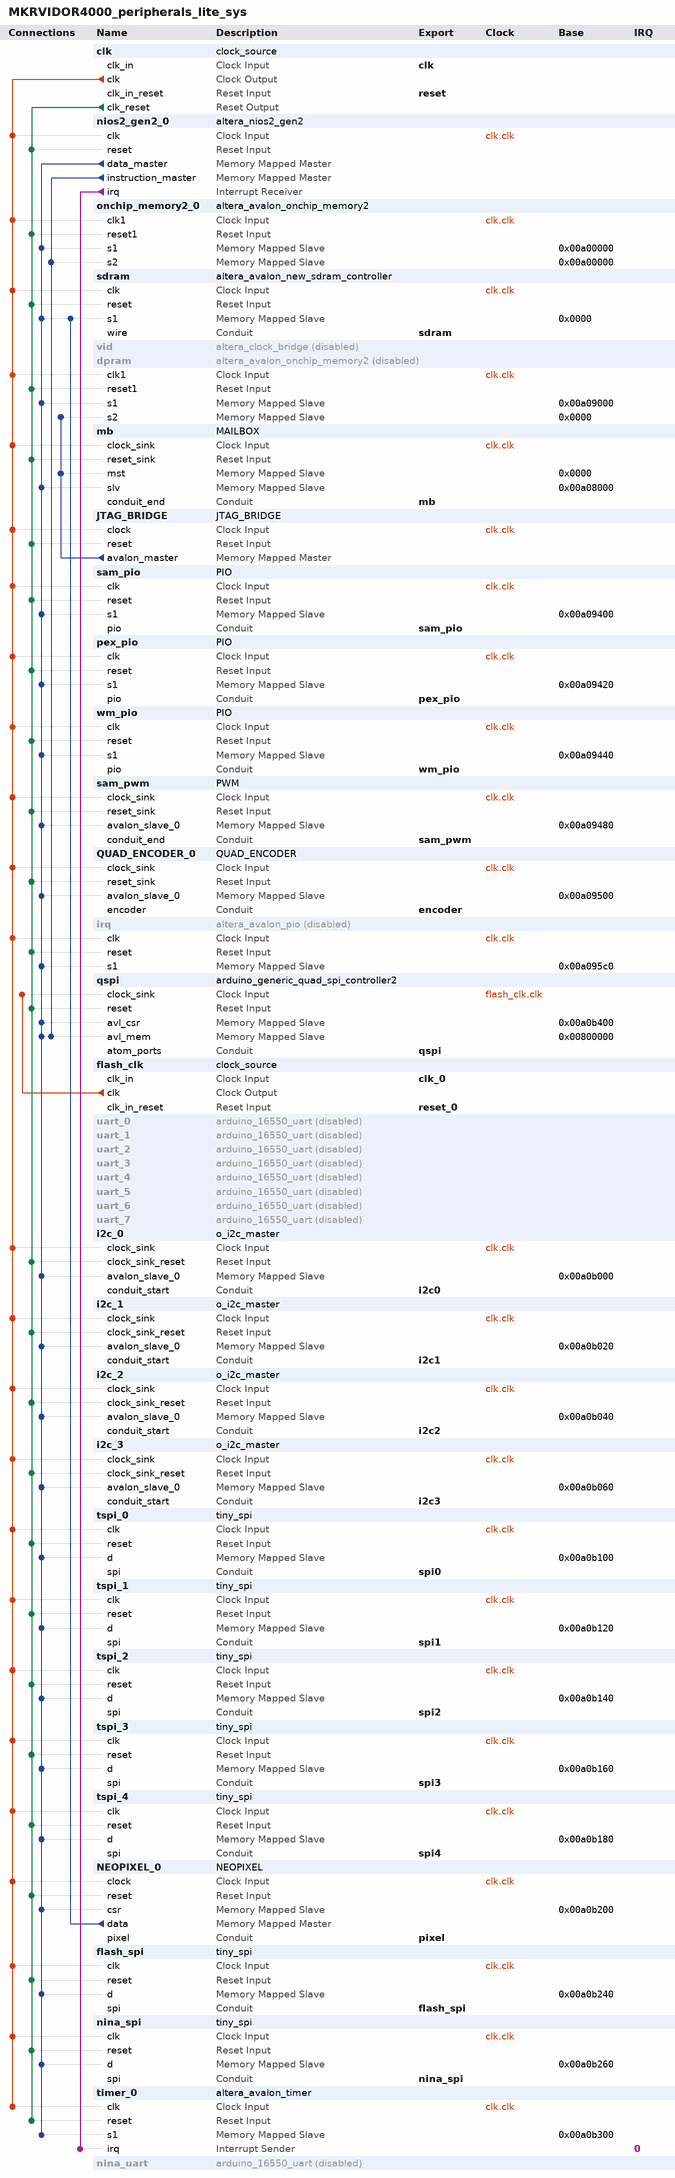
[diagram p0: system contents]
# Platform Designer (Qsys) system MKRVIDOR4000_peripherals_lite_sys, Cyclone 10 LP 10CL016YU256C8G
# Parameters at their usual value, and those the tool derives, are not listed.
package require -exact qsys 18.1
create_system MKRVIDOR4000_peripherals_lite_sys
set_project_property DEVICE_FAMILY {Cyclone 10 LP}
set_project_property DEVICE 10CL016YU256C8G

add_instance clk clock_source 18.1
set_instance_parameter_value clk clockFrequency 100000000

add_instance nios2_gen2_0 altera_nios2_gen2 18.1
set_instance_parameter_value nios2_gen2_0 dcache_size 0
set_instance_parameter_value nios2_gen2_0 debug_enabled false
set_instance_parameter_value nios2_gen2_0 debug_hwbreakpoint 4
set_instance_parameter_value nios2_gen2_0 exceptionSlave onchip_memory2_0.s2
set_instance_parameter_value nios2_gen2_0 icache_size 0
set_instance_parameter_value nios2_gen2_0 impl Tiny
set_instance_parameter_value nios2_gen2_0 resetSlave onchip_memory2_0.s2
set_instance_parameter_value nios2_gen2_0 setting_interruptControllerType External
set_instance_parameter_value nios2_gen2_0 setting_shadowRegisterSets 1

add_instance onchip_memory2_0 altera_avalon_onchip_memory2 18.1
set_instance_parameter_value onchip_memory2_0 dataWidth 32
set_instance_parameter_value onchip_memory2_0 dualPort true
set_instance_parameter_value onchip_memory2_0 initMemContent true
set_instance_parameter_value onchip_memory2_0 initializationFileName onchip_mem.hex
set_instance_parameter_value onchip_memory2_0 memorySize 32768
set_instance_parameter_value onchip_memory2_0 singleClockOperation true

add_instance sdram altera_avalon_new_sdram_controller 18.1
set_instance_parameter_value sdram TAC 5.4
set_instance_parameter_value sdram TRCD 20.0
set_instance_parameter_value sdram TRP 20.0
set_instance_parameter_value sdram casLatency 2
set_instance_parameter_value sdram columnWidth 8
set_instance_parameter_value sdram dataWidth 16
set_instance_parameter_value sdram generateSimulationModel false
set_instance_parameter_value sdram model single_Micron_MT48LC4M32B2_7_chip
set_instance_parameter_value sdram numberOfBanks 4
set_instance_parameter_value sdram numberOfChipSelects 1
set_instance_parameter_value sdram powerUpDelay 200.0
set_instance_parameter_value sdram refreshPeriod 31.25
set_instance_parameter_value sdram rowWidth 12

add_instance vid altera_clock_bridge 18.1
set_instance_property vid ENABLED false
set_instance_parameter_value vid DERIVED_CLOCK_RATE 0
set_instance_parameter_value vid EXPLICIT_CLOCK_RATE 0

add_instance dpram altera_avalon_onchip_memory2 18.1
set_instance_property dpram ENABLED false
set_instance_parameter_value dpram dataWidth 32
set_instance_parameter_value dpram dualPort true
set_instance_parameter_value dpram initMemContent true
set_instance_parameter_value dpram initializationFileName onchip_mem.hex
set_instance_parameter_value dpram memorySize 1024
set_instance_parameter_value dpram singleClockOperation true

add_instance mb MAILBOX 1.0
set_instance_parameter_value mb pDPRAM_BITS 9
set_instance_parameter_value mb pFIFO_BITS 4

add_instance JTAG_BRIDGE JTAG_BRIDGE 1.0

add_instance sam_pio PIO 1.0
set_instance_parameter_value sam_pio pBITS 32
set_instance_parameter_value sam_pio pMUX_BITS 2

add_instance pex_pio PIO 1.0
set_instance_parameter_value pex_pio pBITS 32
set_instance_parameter_value pex_pio pMUX_BITS 2

add_instance wm_pio PIO 1.0
set_instance_parameter_value wm_pio pBITS 32
set_instance_parameter_value wm_pio pMUX_BITS 2

add_instance sam_pwm PWM 1.0
set_instance_parameter_value sam_pwm pCHANNELS 23
set_instance_parameter_value sam_pwm pMATCH_BITS 16
set_instance_parameter_value sam_pwm pPRESCALER_BITS 32

add_instance QUAD_ENCODER_0 QUAD_ENCODER 1.0
set_instance_parameter_value QUAD_ENCODER_0 pENCODERS 11
set_instance_parameter_value QUAD_ENCODER_0 pENCODER_PRECISION 16

add_instance irq altera_avalon_pio 18.1
set_instance_property irq ENABLED false
set_instance_parameter_value irq captureEdge true
set_instance_parameter_value irq direction InOut
set_instance_parameter_value irq generateIRQ true
set_instance_parameter_value irq irqType EDGE
set_instance_parameter_value irq width 2

add_instance qspi arduino_generic_quad_spi_controller2 18.1
set_instance_parameter_value qspi ATOM UNIDIRECTIONAL
set_instance_parameter_value qspi CHIP_SELS 1
set_instance_parameter_value qspi DDASI 1
set_instance_parameter_value qspi FLASH_TYPE N25Q16
set_instance_parameter_value qspi GUI_USE_GPIO false
set_instance_parameter_value qspi IO_MODE QUAD
set_instance_parameter_value qspi clkFreq 40000000

add_instance flash_clk clock_source 18.1
set_instance_parameter_value flash_clk clockFrequency 40000000

add_instance uart_0 arduino_16550_uart 18.1
set_instance_property uart_0 ENABLED false
set_instance_parameter_value uart_0 DMA_EXTRA 0
set_instance_parameter_value uart_0 FAMILY {Cyclone 10 LP}
set_instance_parameter_value uart_0 FIFO_DEPTH 128
set_instance_parameter_value uart_0 FIFO_HWFC 0
set_instance_parameter_value uart_0 FIFO_MODE 0
set_instance_parameter_value uart_0 FIFO_SWFC 0
set_instance_parameter_value uart_0 FIFO_WATERMARK 0
set_instance_parameter_value uart_0 MEM_BLOCK_TYPE AUTO

add_instance uart_1 arduino_16550_uart 18.1
set_instance_property uart_1 ENABLED false
set_instance_parameter_value uart_1 DMA_EXTRA 0
set_instance_parameter_value uart_1 FAMILY {Cyclone 10 LP}
set_instance_parameter_value uart_1 FIFO_DEPTH 128
set_instance_parameter_value uart_1 FIFO_HWFC 0
set_instance_parameter_value uart_1 FIFO_MODE 0
set_instance_parameter_value uart_1 FIFO_SWFC 0
set_instance_parameter_value uart_1 FIFO_WATERMARK 0
set_instance_parameter_value uart_1 MEM_BLOCK_TYPE AUTO

add_instance uart_2 arduino_16550_uart 18.1
set_instance_property uart_2 ENABLED false
set_instance_parameter_value uart_2 DMA_EXTRA 0
set_instance_parameter_value uart_2 FAMILY {Cyclone 10 LP}
set_instance_parameter_value uart_2 FIFO_DEPTH 128
set_instance_parameter_value uart_2 FIFO_HWFC 0
set_instance_parameter_value uart_2 FIFO_MODE 0
set_instance_parameter_value uart_2 FIFO_SWFC 0
set_instance_parameter_value uart_2 FIFO_WATERMARK 0
set_instance_parameter_value uart_2 MEM_BLOCK_TYPE AUTO

add_instance uart_3 arduino_16550_uart 18.1
set_instance_property uart_3 ENABLED false
set_instance_parameter_value uart_3 DMA_EXTRA 0
set_instance_parameter_value uart_3 FAMILY {Cyclone 10 LP}
set_instance_parameter_value uart_3 FIFO_DEPTH 128
set_instance_parameter_value uart_3 FIFO_HWFC 0
set_instance_parameter_value uart_3 FIFO_MODE 0
set_instance_parameter_value uart_3 FIFO_SWFC 0
set_instance_parameter_value uart_3 FIFO_WATERMARK 0
set_instance_parameter_value uart_3 MEM_BLOCK_TYPE AUTO

add_instance uart_4 arduino_16550_uart 18.1
set_instance_property uart_4 ENABLED false
set_instance_parameter_value uart_4 DMA_EXTRA 0
set_instance_parameter_value uart_4 FAMILY {Cyclone 10 LP}
set_instance_parameter_value uart_4 FIFO_DEPTH 128
set_instance_parameter_value uart_4 FIFO_HWFC 0
set_instance_parameter_value uart_4 FIFO_MODE 0
set_instance_parameter_value uart_4 FIFO_SWFC 0
set_instance_parameter_value uart_4 FIFO_WATERMARK 0
set_instance_parameter_value uart_4 MEM_BLOCK_TYPE AUTO

add_instance uart_5 arduino_16550_uart 18.1
set_instance_property uart_5 ENABLED false
set_instance_parameter_value uart_5 DMA_EXTRA 0
set_instance_parameter_value uart_5 FAMILY {Cyclone 10 LP}
set_instance_parameter_value uart_5 FIFO_DEPTH 128
set_instance_parameter_value uart_5 FIFO_HWFC 0
set_instance_parameter_value uart_5 FIFO_MODE 0
set_instance_parameter_value uart_5 FIFO_SWFC 0
set_instance_parameter_value uart_5 FIFO_WATERMARK 0
set_instance_parameter_value uart_5 MEM_BLOCK_TYPE AUTO

add_instance uart_6 arduino_16550_uart 18.1
set_instance_property uart_6 ENABLED false
set_instance_parameter_value uart_6 DMA_EXTRA 0
set_instance_parameter_value uart_6 FAMILY {Cyclone 10 LP}
set_instance_parameter_value uart_6 FIFO_DEPTH 128
set_instance_parameter_value uart_6 FIFO_HWFC 0
set_instance_parameter_value uart_6 FIFO_MODE 0
set_instance_parameter_value uart_6 FIFO_SWFC 0
set_instance_parameter_value uart_6 FIFO_WATERMARK 0
set_instance_parameter_value uart_6 MEM_BLOCK_TYPE AUTO

add_instance uart_7 arduino_16550_uart 18.1
set_instance_property uart_7 ENABLED false
set_instance_parameter_value uart_7 DMA_EXTRA 0
set_instance_parameter_value uart_7 FAMILY {Cyclone 10 LP}
set_instance_parameter_value uart_7 FIFO_DEPTH 256
set_instance_parameter_value uart_7 FIFO_HWFC 0
set_instance_parameter_value uart_7 FIFO_MODE 0
set_instance_parameter_value uart_7 FIFO_SWFC 0
set_instance_parameter_value uart_7 FIFO_WATERMARK 0
set_instance_parameter_value uart_7 MEM_BLOCK_TYPE AUTO

add_instance i2c_0 o_i2c_master 1.0

add_instance i2c_1 o_i2c_master 1.0

add_instance i2c_2 o_i2c_master 1.0

add_instance i2c_3 o_i2c_master 1.0

add_instance tspi_0 tiny_spi 1.0
set_instance_parameter_value tspi_0 BAUD_DIV 0
set_instance_parameter_value tspi_0 BAUD_WIDTH 8
set_instance_parameter_value tspi_0 SPI_MODE 0

add_instance tspi_1 tiny_spi 1.0
set_instance_parameter_value tspi_1 BAUD_DIV 0
set_instance_parameter_value tspi_1 BAUD_WIDTH 8
set_instance_parameter_value tspi_1 SPI_MODE 0

add_instance tspi_2 tiny_spi 1.0
set_instance_parameter_value tspi_2 BAUD_DIV 0
set_instance_parameter_value tspi_2 BAUD_WIDTH 8
set_instance_parameter_value tspi_2 SPI_MODE 0

add_instance tspi_3 tiny_spi 1.0
set_instance_parameter_value tspi_3 BAUD_DIV 0
set_instance_parameter_value tspi_3 BAUD_WIDTH 8
set_instance_parameter_value tspi_3 SPI_MODE 0

add_instance tspi_4 tiny_spi 1.0
set_instance_parameter_value tspi_4 BAUD_DIV 0
set_instance_parameter_value tspi_4 BAUD_WIDTH 8
set_instance_parameter_value tspi_4 SPI_MODE 0

add_instance NEOPIXEL_0 NEOPIXEL 1.0
set_instance_parameter_value NEOPIXEL_0 pCHANNELS 4
set_instance_parameter_value NEOPIXEL_0 pSTART_ADDRESS 0

add_instance flash_spi tiny_spi 1.0
set_instance_parameter_value flash_spi BAUD_DIV 0
set_instance_parameter_value flash_spi BAUD_WIDTH 8
set_instance_parameter_value flash_spi SPI_MODE 0

add_instance nina_spi tiny_spi 1.0
set_instance_parameter_value nina_spi BAUD_DIV 0
set_instance_parameter_value nina_spi BAUD_WIDTH 8
set_instance_parameter_value nina_spi SPI_MODE 0

add_instance timer_0 altera_avalon_timer 18.1
set_instance_parameter_value timer_0 period 1
set_instance_parameter_value timer_0 periodUnits MSEC

add_instance nina_uart arduino_16550_uart 18.1
set_instance_property nina_uart ENABLED false
set_instance_parameter_value nina_uart DMA_EXTRA 0
set_instance_parameter_value nina_uart FAMILY {Cyclone 10 LP}
set_instance_parameter_value nina_uart FIFO_DEPTH 128
set_instance_parameter_value nina_uart FIFO_HWFC 0
set_instance_parameter_value nina_uart FIFO_MODE 0
set_instance_parameter_value nina_uart FIFO_SWFC 0
set_instance_parameter_value nina_uart FIFO_WATERMARK 0
set_instance_parameter_value nina_uart MEM_BLOCK_TYPE AUTO

# connections
add_connection clk.clk dpram.clk1 clock
add_connection clk.clk flash_spi.clk clock
add_connection clk.clk i2c_0.clock_sink clock
add_connection clk.clk i2c_1.clock_sink clock
add_connection clk.clk i2c_2.clock_sink clock
add_connection clk.clk i2c_3.clock_sink clock
add_connection clk.clk irq.clk clock
add_connection clk.clk JTAG_BRIDGE.clock clock
add_connection clk.clk mb.clock_sink clock
add_connection clk.clk NEOPIXEL_0.clock clock
add_connection clk.clk nina_spi.clk clock
add_connection clk.clk nios2_gen2_0.clk clock
add_connection clk.clk onchip_memory2_0.clk1 clock
add_connection clk.clk pex_pio.clk clock
add_connection clk.clk QUAD_ENCODER_0.clock_sink clock
add_connection clk.clk sam_pio.clk clock
add_connection clk.clk sam_pwm.clock_sink clock
add_connection clk.clk sdram.clk clock
add_connection clk.clk timer_0.clk clock
add_connection clk.clk tspi_0.clk clock
add_connection clk.clk tspi_1.clk clock
add_connection clk.clk tspi_2.clk clock
add_connection clk.clk tspi_3.clk clock
add_connection clk.clk tspi_4.clk clock
add_connection clk.clk wm_pio.clk clock
add_connection flash_clk.clk qspi.clock_sink clock
add_connection clk.clk_reset dpram.reset1 reset
add_connection clk.clk_reset flash_spi.reset reset
add_connection clk.clk_reset i2c_0.clock_sink_reset reset
add_connection clk.clk_reset i2c_1.clock_sink_reset reset
add_connection clk.clk_reset i2c_2.clock_sink_reset reset
add_connection clk.clk_reset i2c_3.clock_sink_reset reset
add_connection clk.clk_reset irq.reset reset
add_connection clk.clk_reset JTAG_BRIDGE.reset reset
add_connection clk.clk_reset mb.reset_sink reset
add_connection clk.clk_reset NEOPIXEL_0.reset reset
add_connection clk.clk_reset nina_spi.reset reset
add_connection clk.clk_reset nios2_gen2_0.reset reset
add_connection clk.clk_reset onchip_memory2_0.reset1 reset
add_connection clk.clk_reset pex_pio.reset reset
add_connection clk.clk_reset qspi.reset reset
add_connection clk.clk_reset QUAD_ENCODER_0.reset_sink reset
add_connection clk.clk_reset sam_pio.reset reset
add_connection clk.clk_reset sam_pwm.reset_sink reset
add_connection clk.clk_reset sdram.reset reset
add_connection clk.clk_reset timer_0.reset reset
add_connection clk.clk_reset tspi_0.reset reset
add_connection clk.clk_reset tspi_1.reset reset
add_connection clk.clk_reset tspi_2.reset reset
add_connection clk.clk_reset tspi_3.reset reset
add_connection clk.clk_reset tspi_4.reset reset
add_connection clk.clk_reset wm_pio.reset reset
add_connection JTAG_BRIDGE.avalon_master dpram.s2 avalon
set_connection_parameter_value JTAG_BRIDGE.avalon_master/dpram.s2 baseAddress 0x0000
add_connection JTAG_BRIDGE.avalon_master mb.mst avalon
set_connection_parameter_value JTAG_BRIDGE.avalon_master/mb.mst baseAddress 0x0000
add_connection NEOPIXEL_0.data sdram.s1 avalon
set_connection_parameter_value NEOPIXEL_0.data/sdram.s1 baseAddress 0x0000
add_connection nios2_gen2_0.data_master dpram.s1 avalon
set_connection_parameter_value nios2_gen2_0.data_master/dpram.s1 baseAddress 0x00a09000
add_connection nios2_gen2_0.data_master flash_spi.d avalon
set_connection_parameter_value nios2_gen2_0.data_master/flash_spi.d baseAddress 0x00a0b240
add_connection nios2_gen2_0.data_master i2c_0.avalon_slave_0 avalon
set_connection_parameter_value nios2_gen2_0.data_master/i2c_0.avalon_slave_0 baseAddress 0x00a0b000
add_connection nios2_gen2_0.data_master i2c_1.avalon_slave_0 avalon
set_connection_parameter_value nios2_gen2_0.data_master/i2c_1.avalon_slave_0 baseAddress 0x00a0b020
add_connection nios2_gen2_0.data_master i2c_2.avalon_slave_0 avalon
set_connection_parameter_value nios2_gen2_0.data_master/i2c_2.avalon_slave_0 baseAddress 0x00a0b040
add_connection nios2_gen2_0.data_master i2c_3.avalon_slave_0 avalon
set_connection_parameter_value nios2_gen2_0.data_master/i2c_3.avalon_slave_0 baseAddress 0x00a0b060
add_connection nios2_gen2_0.data_master irq.s1 avalon
set_connection_parameter_value nios2_gen2_0.data_master/irq.s1 baseAddress 0x00a095c0
add_connection nios2_gen2_0.data_master mb.slv avalon
set_connection_parameter_value nios2_gen2_0.data_master/mb.slv baseAddress 0x00a08000
add_connection nios2_gen2_0.data_master NEOPIXEL_0.csr avalon
set_connection_parameter_value nios2_gen2_0.data_master/NEOPIXEL_0.csr baseAddress 0x00a0b200
add_connection nios2_gen2_0.data_master nina_spi.d avalon
set_connection_parameter_value nios2_gen2_0.data_master/nina_spi.d baseAddress 0x00a0b260
add_connection nios2_gen2_0.data_master onchip_memory2_0.s1 avalon
set_connection_parameter_value nios2_gen2_0.data_master/onchip_memory2_0.s1 baseAddress 0x00a00000
add_connection nios2_gen2_0.data_master pex_pio.s1 avalon
set_connection_parameter_value nios2_gen2_0.data_master/pex_pio.s1 baseAddress 0x00a09420
add_connection nios2_gen2_0.data_master qspi.avl_csr avalon
set_connection_parameter_value nios2_gen2_0.data_master/qspi.avl_csr baseAddress 0x00a0b400
add_connection nios2_gen2_0.data_master qspi.avl_mem avalon
set_connection_parameter_value nios2_gen2_0.data_master/qspi.avl_mem baseAddress 0x00800000
add_connection nios2_gen2_0.data_master QUAD_ENCODER_0.avalon_slave_0 avalon
set_connection_parameter_value nios2_gen2_0.data_master/QUAD_ENCODER_0.avalon_slave_0 baseAddress 0x00a09500
add_connection nios2_gen2_0.data_master sam_pio.s1 avalon
set_connection_parameter_value nios2_gen2_0.data_master/sam_pio.s1 baseAddress 0x00a09400
add_connection nios2_gen2_0.data_master sam_pwm.avalon_slave_0 avalon
set_connection_parameter_value nios2_gen2_0.data_master/sam_pwm.avalon_slave_0 baseAddress 0x00a09480
add_connection nios2_gen2_0.data_master sdram.s1 avalon
set_connection_parameter_value nios2_gen2_0.data_master/sdram.s1 baseAddress 0x0000
add_connection nios2_gen2_0.data_master timer_0.s1 avalon
set_connection_parameter_value nios2_gen2_0.data_master/timer_0.s1 baseAddress 0x00a0b300
add_connection nios2_gen2_0.data_master tspi_0.d avalon
set_connection_parameter_value nios2_gen2_0.data_master/tspi_0.d baseAddress 0x00a0b100
add_connection nios2_gen2_0.data_master tspi_1.d avalon
set_connection_parameter_value nios2_gen2_0.data_master/tspi_1.d baseAddress 0x00a0b120
add_connection nios2_gen2_0.data_master tspi_2.d avalon
set_connection_parameter_value nios2_gen2_0.data_master/tspi_2.d baseAddress 0x00a0b140
add_connection nios2_gen2_0.data_master tspi_3.d avalon
set_connection_parameter_value nios2_gen2_0.data_master/tspi_3.d baseAddress 0x00a0b160
add_connection nios2_gen2_0.data_master tspi_4.d avalon
set_connection_parameter_value nios2_gen2_0.data_master/tspi_4.d baseAddress 0x00a0b180
add_connection nios2_gen2_0.data_master wm_pio.s1 avalon
set_connection_parameter_value nios2_gen2_0.data_master/wm_pio.s1 baseAddress 0x00a09440
add_connection nios2_gen2_0.instruction_master onchip_memory2_0.s2 avalon
set_connection_parameter_value nios2_gen2_0.instruction_master/onchip_memory2_0.s2 baseAddress 0x00a00000
add_connection nios2_gen2_0.instruction_master qspi.avl_mem avalon
set_connection_parameter_value nios2_gen2_0.instruction_master/qspi.avl_mem baseAddress 0x00800000
add_connection nios2_gen2_0.irq timer_0.irq interrupt
set_connection_parameter_value nios2_gen2_0.irq/timer_0.irq irqNumber 0

# exported interfaces
add_interface clk clock sink
set_interface_property clk EXPORT_OF clk.clk_in
add_interface clk_0 clock sink
set_interface_property clk_0 EXPORT_OF flash_clk.clk_in
add_interface encoder conduit end
set_interface_property encoder EXPORT_OF QUAD_ENCODER_0.encoder
add_interface flash_spi conduit end
set_interface_property flash_spi EXPORT_OF flash_spi.spi
add_interface i2c0 conduit end
set_interface_property i2c0 EXPORT_OF i2c_0.conduit_start
add_interface i2c1 conduit end
set_interface_property i2c1 EXPORT_OF i2c_1.conduit_start
add_interface i2c2 conduit end
set_interface_property i2c2 EXPORT_OF i2c_2.conduit_start
add_interface i2c3 conduit end
set_interface_property i2c3 EXPORT_OF i2c_3.conduit_start
add_interface mb conduit end
set_interface_property mb EXPORT_OF mb.conduit_end
add_interface nina_spi conduit end
set_interface_property nina_spi EXPORT_OF nina_spi.spi
add_interface pex_pio conduit end
set_interface_property pex_pio EXPORT_OF pex_pio.pio
add_interface pixel conduit end
set_interface_property pixel EXPORT_OF NEOPIXEL_0.pixel
add_interface qspi conduit end
set_interface_property qspi EXPORT_OF qspi.atom_ports
add_interface reset reset sink
set_interface_property reset EXPORT_OF clk.clk_in_reset
add_interface reset_0 reset sink
set_interface_property reset_0 EXPORT_OF flash_clk.clk_in_reset
add_interface sam_pio conduit end
set_interface_property sam_pio EXPORT_OF sam_pio.pio
add_interface sam_pwm conduit end
set_interface_property sam_pwm EXPORT_OF sam_pwm.conduit_end
add_interface sdram conduit end
set_interface_property sdram EXPORT_OF sdram.wire
add_interface spi0 conduit end
set_interface_property spi0 EXPORT_OF tspi_0.spi
add_interface spi1 conduit end
set_interface_property spi1 EXPORT_OF tspi_1.spi
add_interface spi2 conduit end
set_interface_property spi2 EXPORT_OF tspi_2.spi
add_interface spi3 conduit end
set_interface_property spi3 EXPORT_OF tspi_3.spi
add_interface spi4 conduit end
set_interface_property spi4 EXPORT_OF tspi_4.spi
add_interface wm_pio conduit end
set_interface_property wm_pio EXPORT_OF wm_pio.pio

set_interconnect_requirement {$system} qsys_mm.clockCrossingAdapter HANDSHAKE
set_interconnect_requirement {$system} qsys_mm.enableEccProtection FALSE
set_interconnect_requirement {$system} qsys_mm.insertDefaultSlave FALSE
set_interconnect_requirement {$system} qsys_mm.maxAdditionalLatency 1

save_system MKRVIDOR4000_peripherals_lite_sys.qsys
